# EasyEDA schematic SCH_Induction-DC-motor_2025-01-21.json
TITLE: Sheet_1; REV: 1.0; Date: 2025-01-20; Sheet: 1/1; Drawn By: rjdds2017; Company: Your Company
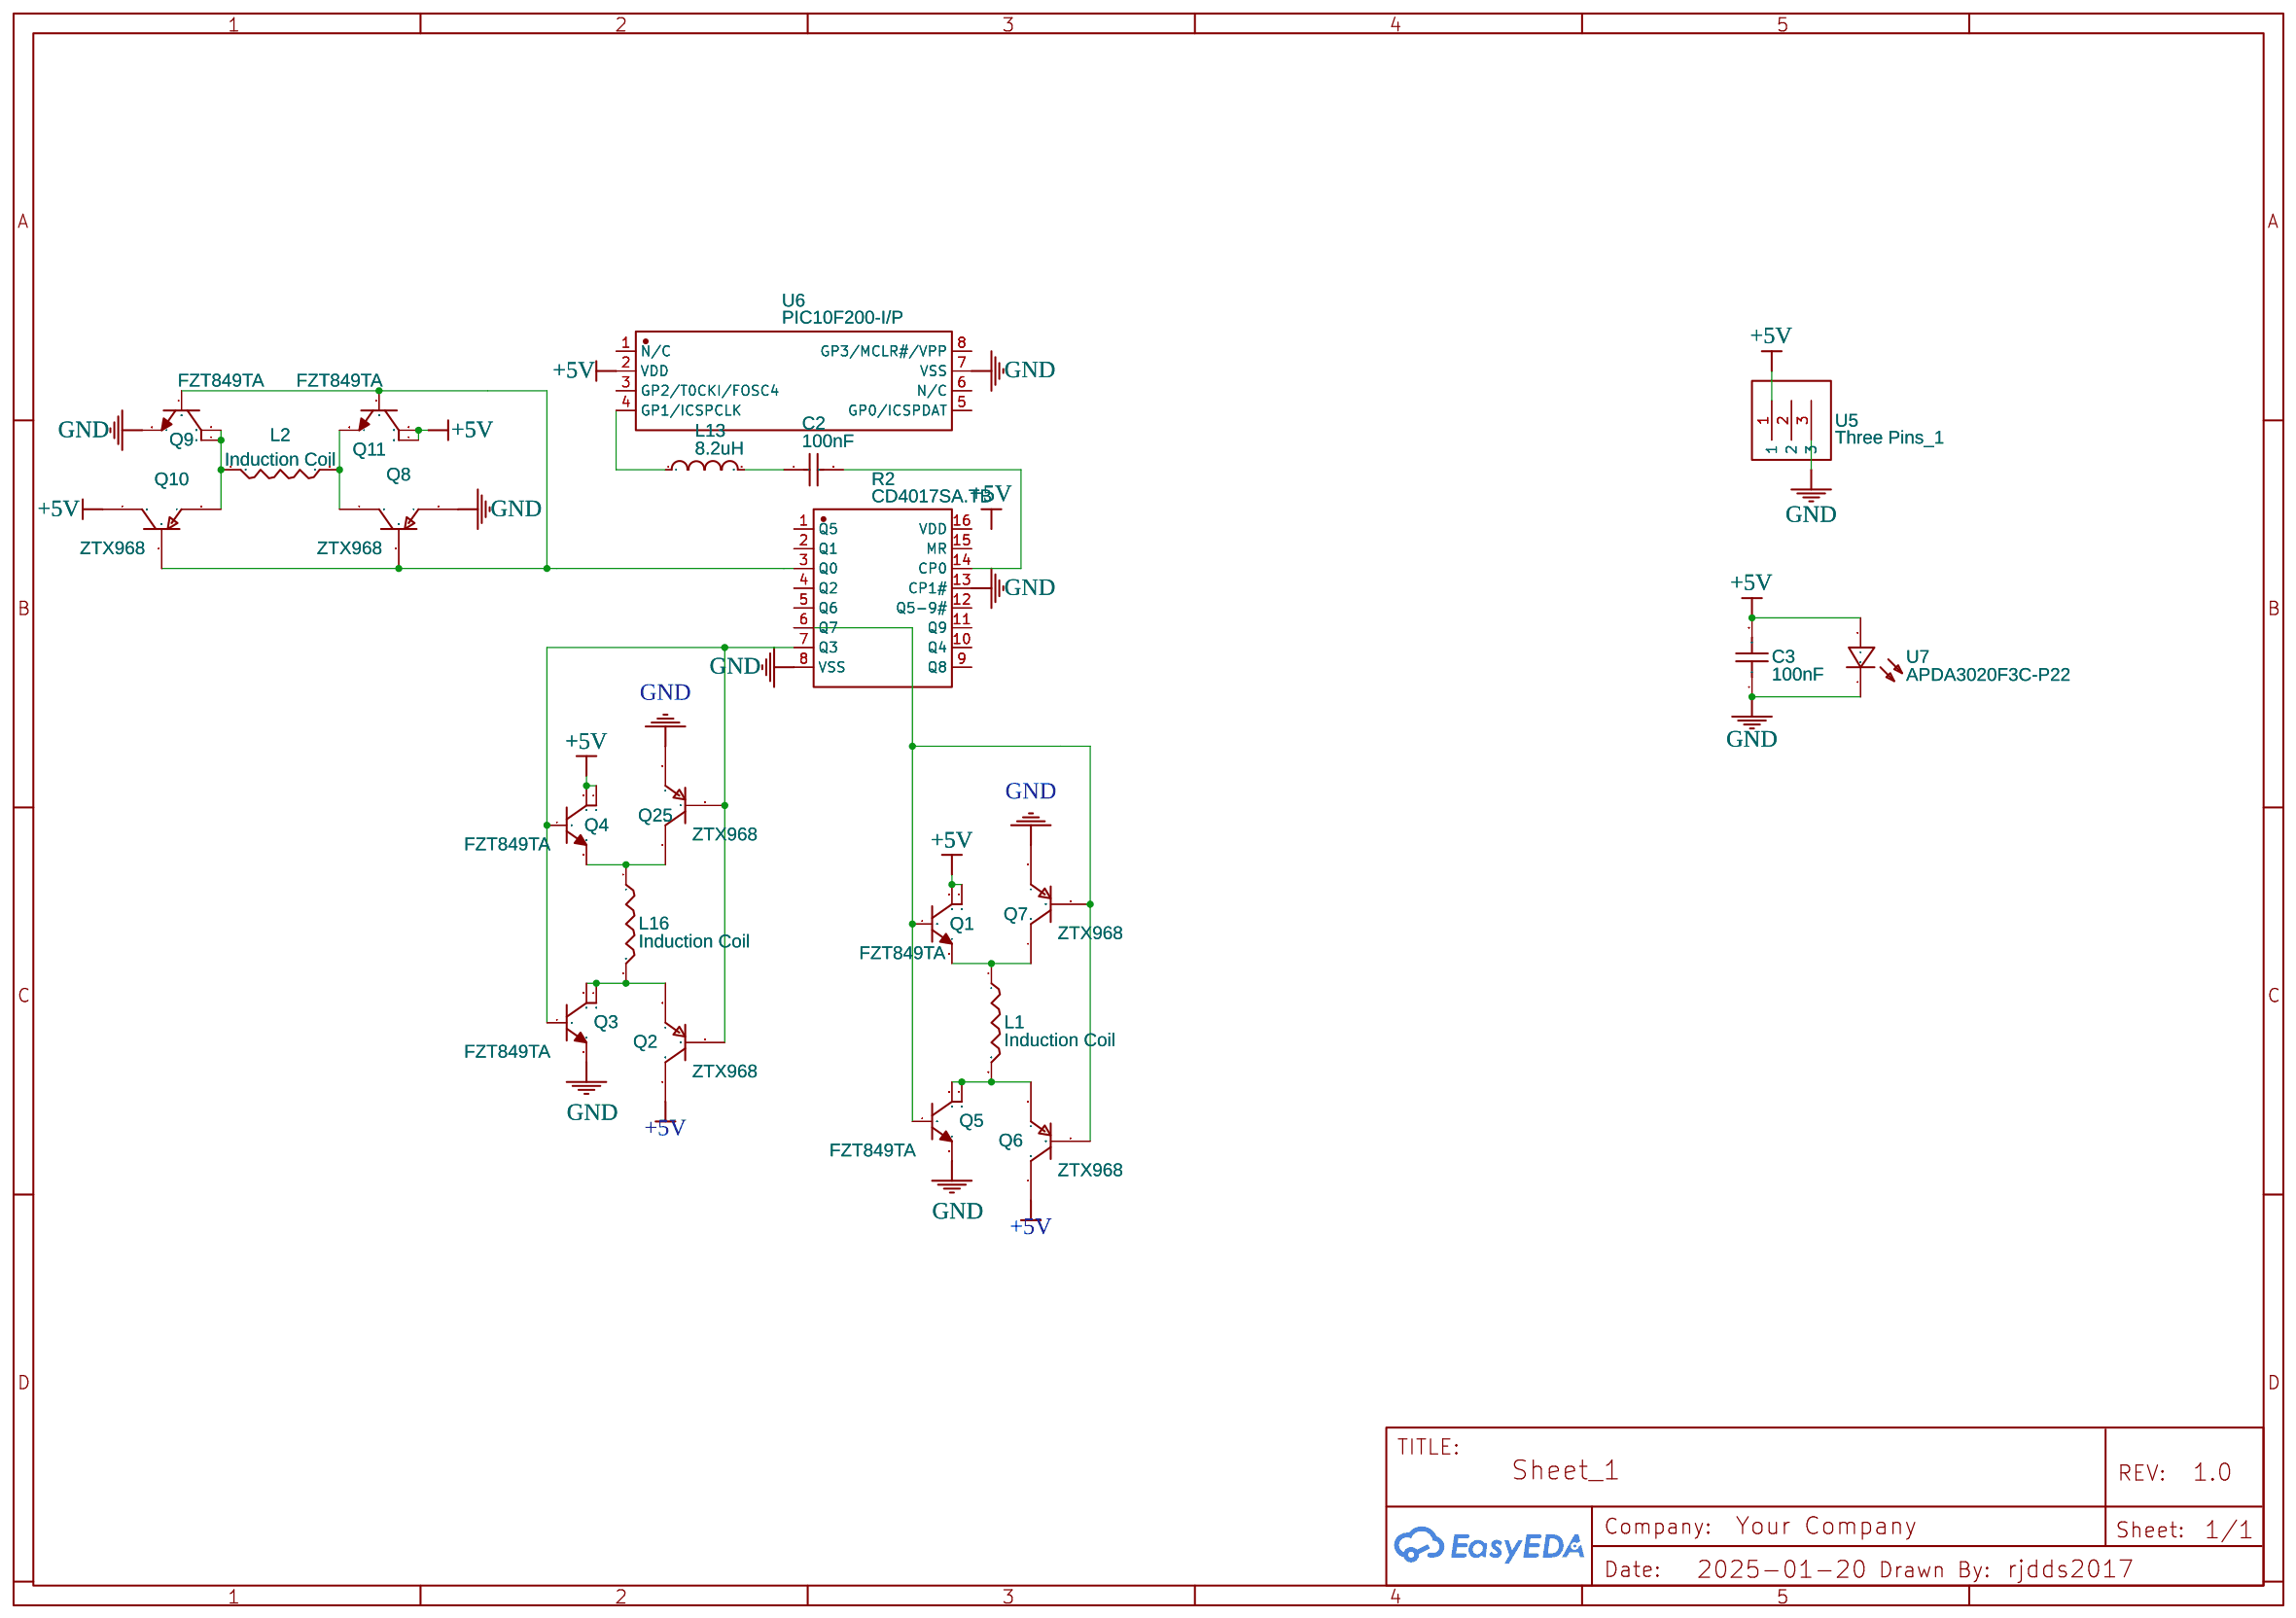
[diagram p0: schematic sheet]

## Parts
C2  100nF  [CAP-TH_L7.2-W3.5-P5.00-D0.5]
C3  100nF  [C0603]
L1  Induction Coil  [DONUT COIL 1COIL]
L2  Induction Coil  [DONUT COIL 1COIL]
L13  8.2uH  [IND-SMD_L6.0-W6.0_SMRH5D28]
L16  Induction Coil  [DONUT COIL 1COIL]
Q1  ZTX968  [E3]
Q2  ZTX968  [E3]
Q3  FZT849TA  [SOT-223_L6.5-W3.5-P2.30-LS7.0-BR]
Q4  ZTX968  [E3]
Q5  FZT849TA  [SOT-223_L6.5-W3.5-P2.30-LS7.0-BR]
Q6  ZTX968  [E3]
Q7  FZT849TA  [SOT-223_L6.5-W3.5-P2.30-LS7.0-BR]
Q8  ZTX968  [E3]
Q9  FZT849TA  [SOT-223_L6.5-W3.5-P2.30-LS7.0-BR]
Q10  ZTX968  [E3]
Q11  FZT849TA  [SOT-223_L6.5-W3.5-P2.30-LS7.0-BR]
Q25  FZT849TA  [SOT-223_L6.5-W3.5-P2.30-LS7.0-BR]
R2  CD4017SA.TB  [SOP-16_L10.0-W3.9-P1.27-LS6.0-BL]
U5  Three Pins_1  [THREE PINS_1]
U6  PIC10F200-I/P  [PDIP-8_L9.3-W6.4-P2.54-LS7.6-BL]
U7  APDA3020F3C-P22  [LED-SMD_L3.0-W2.8-RD_APDA3020VBC-D]

## Library data of the parts
C2 = Calibration capacitor100nF（104）100V,5%: Supplier: LCSC; Manufacturer: ReliaPro; Supplier Part: C26609
C3 = GRM188R72A104KA35D: Supplier: LCSC; Manufacturer: muRata(村田); Supplier Part: C77058; JLCPCB Part Class: Extended Part
L1 L2 L16 = Induction Coil: Contributor: junlakan67
L13 = Power inductorSMRH5D28-8R2NT: Supplier: LCSC; Manufacturer: SXN(顺翔诺); Manufacturer Part: SMRH5D28-8R2NT; Supplier Part: C60101; JLCPCB Part Class: Extended Part
Q1 Q2 Q4 Q6 Q8 Q10 = ZTX968: PNP Silicon Planar Medium Power High-Current Transistor
Q3 Q5 Q7 Q9 Q11 Q25 = FZT849TA: Supplier: LCSC; Manufacturer: DIODES(美台); Supplier Part: C154747; JLCPCB Part Class: Extended Part
R2 = CD4017SA.TB: Contributor: LCSC; Supplier: LCSC; Supplier Part: C2943320; Manufacturer: I-CORE(中微爱芯); JLCPCB Part Class: Extended Part
U5 = Three Pins_1: Contributor: admon.alsamano
U6 = PIC10F200-I/P: Contributor: lcsc; Supplier: LCSC; Supplier Part: C185606; Manufacturer: MICROCHIP(美国微芯)
U7 = APDA3020F3C-P22: Supplier: LCSC; Supplier Part: C7216886; Manufacturer: Kingbright; Contributor: lcsc; JLCPCB Part Class: Extended Part

## Nets
+5V: C3.2 Q2.1(C) Q6.1(C) Q7.2(C) Q7.4(C) Q10.1(C) Q11.2(C) Q11.4(C) Q25.2(C) Q25.4(C) U5.1 U6.2(VDD) U7.2(A)
GND: C3.1 Q1.3(E) Q3.3(E) Q4.3(E) Q5.3(E) Q8.3(E) Q9.3(E) R2.8(VSS) R2.13(CP1#) U5.3 U6.7(VSS) U7.1(C)
Net-(C2-1): C2.1 L13.2
Net-(C2-2): C2.2 R2.14(CP0)
Net-(L1-1): L1.1 Q1.1(C) Q7.3(E)
Net-(L1-2): L1.2 Q5.2(C) Q5.4(C) Q6.3(E)
Net-(L2-1): L2.1 Q8.1(C) Q11.3(E)
Net-(L2-2): L2.2 Q9.2(C) Q9.4(C) Q10.3(E)
Net-(L13-1): L13.1 U6.4(GP1/ICSPCLK)
Net-(L16-1): L16.1 Q4.1(C) Q25.3(E)
Net-(L16-2): L16.2 Q2.3(E) Q3.2(C) Q3.4(C)
Net-(Q1-2): Q1.2(B) Q5.1(B) Q6.2(B) Q7.1(B) R2.6(Q7)
Net-(Q2-2): Q2.2(B) Q3.1(B) Q4.2(B) Q25.1(B) R2.7(Q3)
Net-(Q8-2): Q8.2(B) Q9.1(B) Q10.2(B) Q11.1(B) R2.3(Q0)

Not connected (* = marked no-connect by the designer): R2 1(Q5) 2(Q1) 4(Q2) 5(Q6) 9(Q8) 10(Q4) 11(Q9) 12(Q5-9#) 15(MR) 16(VDD); U5 2; U6 1(N/C) 3(GP2/T0CKI/FOSC4) 5(GP0/ICSPDAT) 6(N/C) 8(GP3/MCLR#/VPP)
